# EAGLE design kicik (EAGLE 7.2.0)
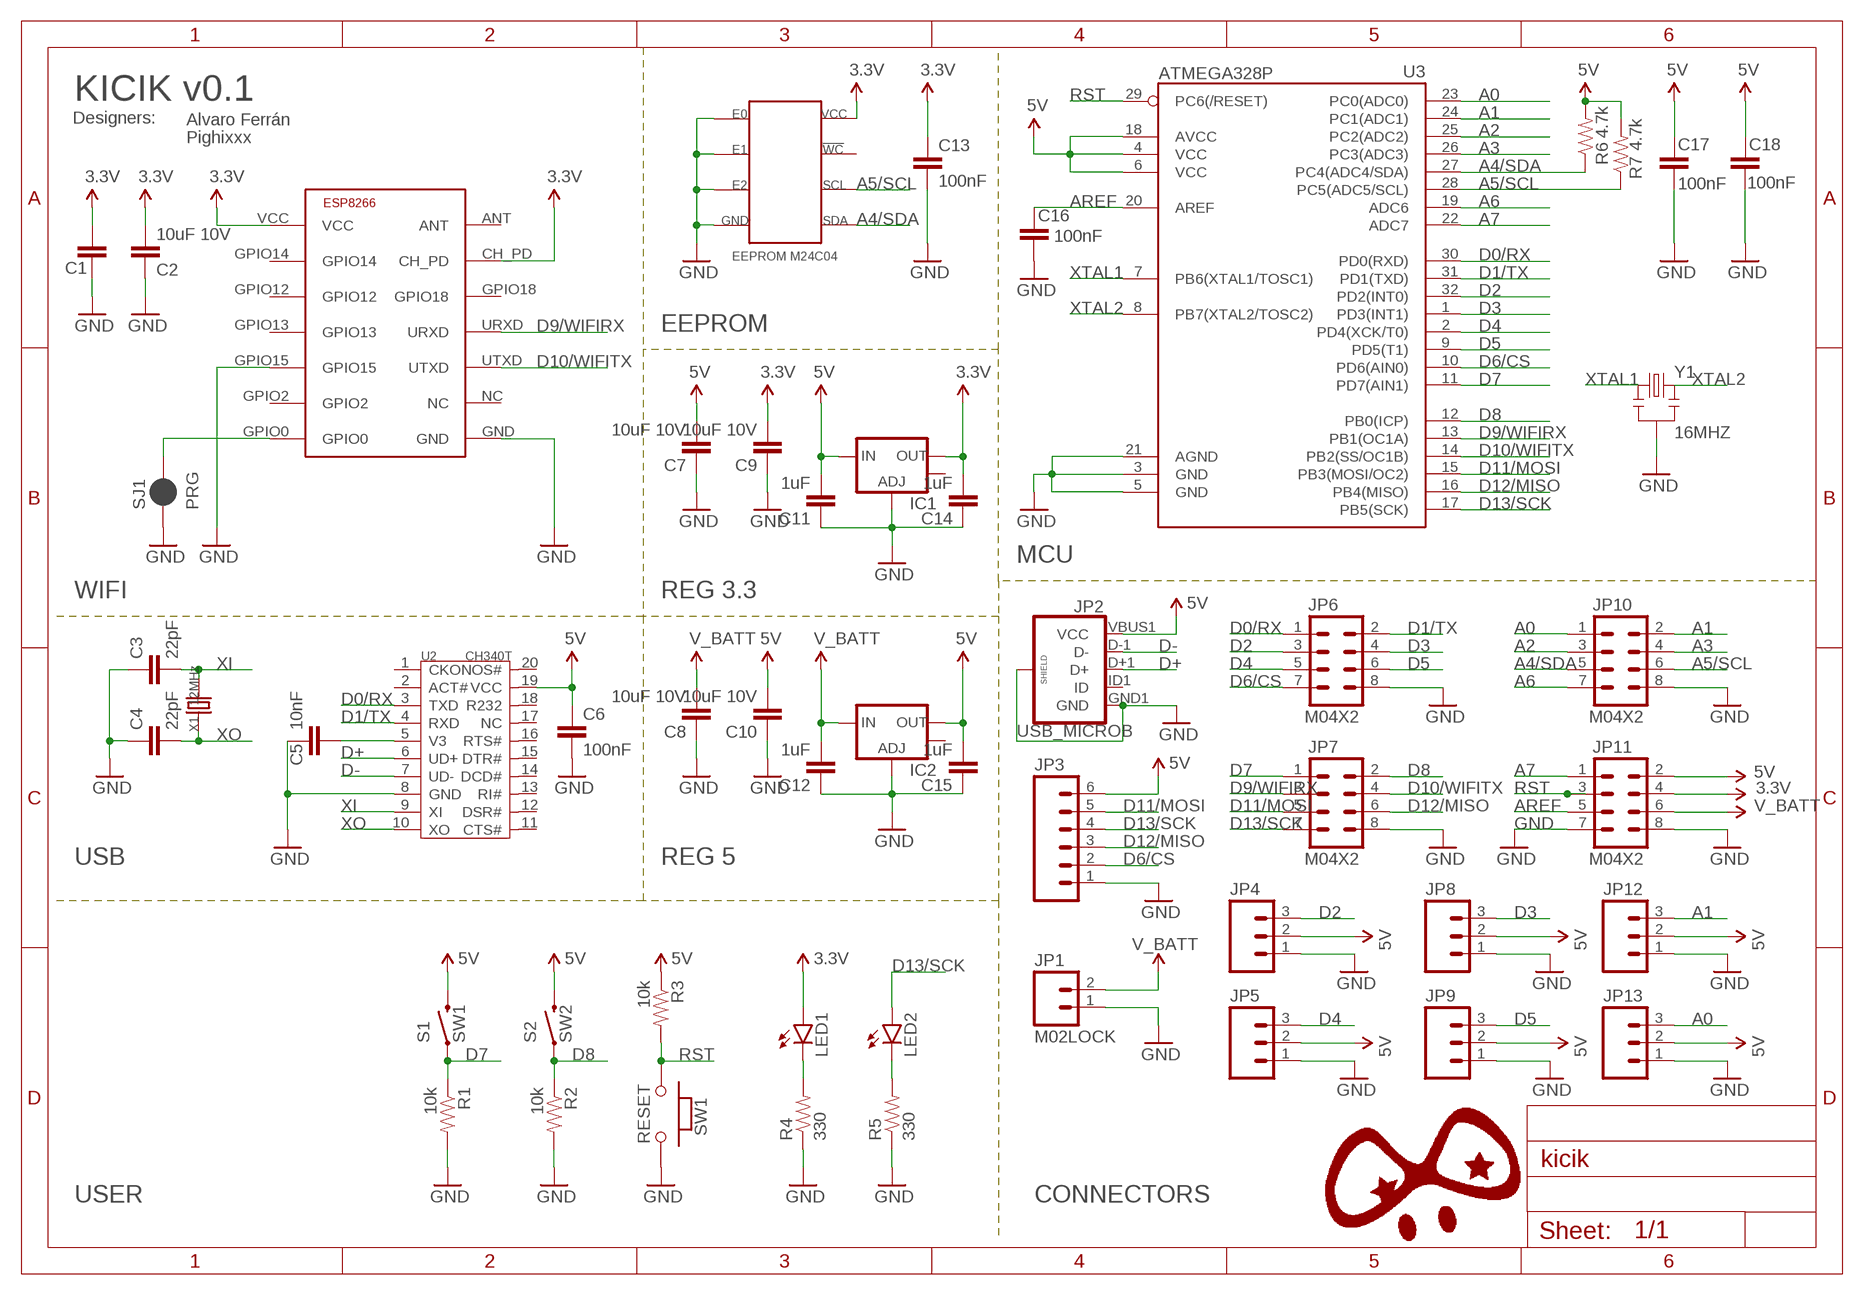
[diagram p0: schematic, sheet 1]

## Parts
C1  0.1uF  CAP0402-CAP  [0402-CAP]
C2  10uF 10V  CAP0402-CAP  [0402-CAP]
C3  22pF  CAP0402-CAP  [0402-CAP]
C4  22pF  CAP0402-CAP  [0402-CAP]
C5  10nF  CAP0402-CAP  [0402-CAP]
C6  100nF  CAP0402-CAP  [0402-CAP]
C7  10uF 10V  CAP0402-CAP  [0402-CAP]
C8  10uF 10V  CAP0402-CAP  [0402-CAP]
C9  10uF 10V  CAP0402-CAP  [0402-CAP]
C10  10uF 10V  CAP0402-CAP  [0402-CAP]
C11  1uF  CAP0402-CAP  [0402-CAP]
C12  1uF  CAP0402-CAP  [0402-CAP]
C13  100nF  CAP0402-CAP  [0402-CAP]
C14  1uF  CAP0402-CAP  [0402-CAP]
C15  1uF  CAP0402-CAP  [0402-CAP]
C16  100nF  CAP0402-CAP  [0402-CAP]
C17  100nF  CAP0402-CAP  [0402-CAP]
C18  100nF  CAP0402-CAP  [0402-CAP]
IC1  V_REG_LM1117SOT223  [SOT223]
IC2  V_REG_LM1117SOT223  [SOT223]
JP1  M02LOCK  [1X02_LOCK]
JP2  USB_MICROB  USB_MICROB_PLUGCONN-11752  [USB-B-MICRO-SMD_V03]
JP3  M06LOCK  [1X06_LOCK]
JP4  M03LOCK  [1X03_LOCK]
JP5  M03LOCK  [1X03_LOCK]
JP6  M04X2  [2X4]
JP7  M04X2  [2X4]
JP8  M03LOCK  [1X03_LOCK]
JP9  M03LOCK  [1X03_LOCK]
JP10  M04X2  [2X4]
JP11  M04X2  [2X4]
JP12  M03LOCK  [1X03_LOCK]
JP13  M03LOCK  [1X03_LOCK]
LED1  LED0603  [LED-0603]
LED2  LED0603  [LED-0603]
M1  M24C04  [SO08]
R1  10k  RESISTOR0402-RES  [0402-RES]
R2  10k  RESISTOR0402-RES  [0402-RES]
R3  10k  RESISTOR0402-RES  [0402-RES]
R4  330  RESISTOR0402-RES  [0402-RES]
R5  330  RESISTOR0402-RES  [0402-RES]
R6  4.7k  RESISTOR0402-RES  [0402-RES]
R7  4.7k  RESISTOR0402-RES  [0402-RES]
S1  SW1  SWITCH-MOMENTARY-2SIDE_EZ  [TACTILE-PTH-SIDEEZ]
S2  SW2  SWITCH-MOMENTARY-2SIDE_EZ  [TACTILE-PTH-SIDEEZ]
SJ1  PRG  JUMPER-PAD-2-NC_BY_PASTE  [PAD-JUMPER-2-NC_BY_PASTE_YES_SILK]
SW1  RESET  PB157  [157SW]
U1  ESP8266  [ESP-03]
U2  CH340T  [SSOP20]
U3  ATMEGA328P  ATMEGA328_SMT  [TQFP32-08]
X1  12MHz  CRYSTAL'5032'  [2P-SMD-5X3.2]
Y1  16MHZ  RESONATOR16MHZ  [RESONATOR-SMD]

## Nets
3.3V: C1.2 C2.2 C9.2 C13.1 C14.2 IC1.2(OUT) JP11.4 LED1.A M1.8(VCC) U1.CH_PD U1.VCC
5V: C6.1 C7.2 C10.2 C11.2 C15.2 C17.1 C18.1 IC1.3(IN) IC2.2(OUT) JP2.VBUS1(VCC) JP3.6 JP4.2 JP5.2 JP8.2 JP9.2 JP11.2 JP12.2 JP13.2 R3.1 R6.2 R7.2 S1.2 S2.2 U2.19(VCC) U3.4(VCC) U3.6(VCC) U3.18(AVCC)
A0: JP10.1 JP13.3 U3.23(PC0(ADC0))
A1: JP10.2 JP12.3 U3.24(PC1(ADC1))
A2: JP10.3 U3.25(PC2(ADC2))
A3: JP10.4 U3.26(PC3(ADC3))
A4/SDA: JP10.5 M1.5(SDA) R6.1 U3.27(PC4(ADC4/SDA))
A5/SCL: JP10.6 M1.6(SCL) R7.1 U3.28(PC5(ADC5/SCL))
A6: JP10.7 U3.19(ADC6)
A7: JP11.1 U3.22(ADC7)
AREF: C16.1 JP11.5 U3.20(AREF)
D0/RX: JP6.1 U2.3(TXD) U3.30(PD0(RXD))
D1/TX: JP6.2 U2.4(RXD) U3.31(PD1(TXD))
D2: JP4.3 JP6.3 U3.32(PD2(INT0))
D3: JP6.4 JP8.3 U3.1(PD3(INT1))
D4: JP5.3 JP6.5 U3.2(PD4(XCK/T0))
D5: JP6.6 JP9.3 U3.9(PD5(T1))
D6/CS: JP3.2 JP6.7 U3.10(PD6(AIN0))
D7: JP7.1 R1.1 S1.1 U3.11(PD7(AIN1))
D8: JP7.2 R2.1 S2.1 U3.12(PB0(ICP))
D9/WIFIRX: JP7.3 U1.URXD U3.13(PB1(OC1A))
D10/WIFITX: JP7.4 U1.UTXD U3.14(PB2(SS/OC1B))
D11/MOSI: JP3.5 JP7.5 U3.15(PB3(MOSI/OC2))
D12/MISO: JP3.3 JP7.6 U3.16(PB4(MISO))
D13/SCK: JP3.4 JP7.7 LED2.A U3.17(PB5(SCK))
D+: JP2.D+1(D+) U2.6(UD+)
D-: JP2.D-1(D-) U2.7(UD-)
GND: C1.1 C2.1 C3.1 C4.1 C5.1 C6.2 C7.1 C8.1 C9.1 C10.1 C11.1 C12.1 C13.2 C14.1 C15.1 C16.2 C17.2 C18.2 IC1.1(ADJ) IC2.1(ADJ) JP1.1 JP2.GND1(GND) JP2.SHIELD1(SHIELD) JP2.SHIELD2(SHIELD) JP2.SHIELD3(SHIELD) JP3.1 JP4.1 JP5.1 JP6.8 JP7.8 JP8.1 JP9.1 JP10.8 JP11.7 JP11.8 JP12.1 JP13.1 M1.1(E0) M1.2(E1) M1.3(E2) M1.4(GND) R1.2 R2.2 R4.1 R5.1 SJ1.1 SW1.2 U1.GND U1.GPIO15 U2.8(GND) U3.3(GND) U3.5(GND) U3.21(AGND) Y1.2
N$2: LED1.C R4.2
N$6: SJ1.2 U1.GPIO0
N$22: LED2.C R5.2
RST: JP11.3 R3.2 SW1.1 U3.29(PC6(/RESET))
V3: C5.2 U2.5(V3)
V_BATT: C8.2 C12.2 IC2.3(IN) JP1.2 JP11.6
XI: C3.2 U2.9(XI) X1.2
XO: C4.2 U2.10(XO) X1.1
XTAL1: U3.7(PB6(XTAL1/TOSC1)) Y1.1
XTAL2: U3.8(PB7(XTAL2/TOSC2)) Y1.3
Unconnected: IC1.4(OUT) IC2.4(OUT) JP2.ID1(ID) M1.7(!WC) U1.ANT U1.GPIO2 U1.GPIO12 U1.GPIO13 U1.GPIO14 U1.GPIO18 U1.NC U2.1(CKO) U2.2(ACT#) U2.11(CTS#) U2.12(DSR#) U2.13(RI#) U2.14(DCD#) U2.15(DTR#) U2.16(RTS#) U2.17(NC) U2.18(R232) U2.20(NOS#)

## Notes on the sheet
- KICIK v0.1
- Designers: | Alvaro Ferrán
- Pighixxx
- EEPROM
- MCU
- WIFI | REG 3.3
- USB | REG 5
- USER | CONNECTORS

## Library data of the parts
C1-C18 = SparkFun-Passives:CAP: Capacitor Standard 0603 ceramic capacitor, and 0.1" leaded capacitor.
IC1 IC2 = SparkFun-PowerIC:V_REG_LM1117: Voltage Regulator LM1117 Standard adjustable voltage regulator but in SMD form. Spark Fun Electronics SKU : COM-00595; PROD_ID: VREG-08170
JP1 = SparkFun-Connectors:M02: Standard 2-pin 0.1" header. Use with - straight break away headers ( PRT-00116) - right angle break away headers (PRT-00553) - swiss pins (PRT-00743) - machine pins (PRT-00117) - female headers (PRT-00115) Molex polarized connector foot print use with: PRT-08233 with associated crimp pins and housings. 2.54_SCREWTERM for use with PRT-10571. 3.5mm Screw Terminal footprints for PRT-08084 5mm Screw Terminal footprints for use with PRT-08432
JP2 = SparkFun-Connectors:USB_MICROB_PLUG: USB Micro-B connectors Some male, some female. Watch your step!; PROD_ID: CONN-11752
JP3 = SparkFun-Connectors:M06: Header 6 Standard 6-pin 0.1" header. Use with straight break away headers (SKU : PRT-00116), right angle break away headers (PRT-00553), swiss pins (PRT-00743), machine pins (PRT-00117), and female headers (PRT-00115). Molex polarized connector foot print use with SKU : PRT-08094 with associated crimp pins and housings. NOTES ON THE VARIANTS LOCK and LOCK_LONGPADS... This footprint was designed to help hold the alignment of a through-hole component (i.e. 6-pin header) while soldering it into place. You may notice that each hole has been shifted either up or down by 0.005 of an inch from it's more standard position (which is a perfectly straight line). This slight alteration caused the pins (the squares in the middle) to touch the edges of the holes. Because they are alternating, it causes a "brace" to hold the component in place. 0.005 has proven to be the perfect amount of "off-center" position when using our standard breakaway headers. Although looks a little odd when you look at the bare footprint, once you have a header in there, the alteration is very hard to notice. Also,if you push a header all the way into place, it is covered up entirely on the bottom side. This idea of altering the position of holes to aid alignment will be further integrated into the Sparkfun Library for other footprints. It can help hold any component with 3 or more connection pins.
JP4 JP5 JP8 JP9 JP12 JP13 = SparkFun-Connectors:M03: Header 3 Standard 3-pin 0.1" header. Use with straight break away headers (SKU : PRT-00116), right angle break away headers (PRT-00553), swiss pins (PRT-00743), machine pins (PRT-00117), and female headers (PRT-00115). Molex polarized connector foot print use with SKU : PRT-08232 with associated crimp pins and housings.
JP6 JP7 JP10 JP11 = SparkFun-Connectors:M04X2: .1" header, two rows of four.
LED1 LED2 = SparkFun-LED:LED: LEDs Standard schematic elements and footprints for 5mm, 3mm, 1206, and 0603 sized LEDs. 5mm - Spark Fun Electronics SKU : COM-00529 (and others)
M1 = pighiXXX:M24C04: ST MICROELECTRONICS M24C04-WMN6P Memory; EEPROM; I2C; 512x8bit; 2.5÷5.5V; SO8
R1-R7 = SparkFun-Passives:RESISTOR: Resistor Basic schematic elements and footprints for 0603, 1206, and PTH resistors.
S1 S2 = SparkFun-Electromechanical:SWITCH-MOMENTARY-2: Various NO switches- pushbuttons, reed, etc
SJ1 = SparkFun-Passives:JUMPER-PAD-2-NC_BY_PASTE
SW1 = MySMD:PB157
U1 = ESP8266:ESP8266: low cost Wifi to Serial Module
U2 = template:CH340T
U3 = SparkFun-DigitalIC:ATMEGA328_SMT: 32-Pin Atmega328 part Commonly used on Arduino compatible boards Available in QFP and QFN packages TQFP is IC-09069 QFN is non-stock; PROD_ID: IC-09069
X1 = Discrete:CRYSTAL*: CRYSTAL
Y1 = SparkFun-FreqCtrl:RESONATOR: Resonator Small SMD resonator. Used, eg, on the Arduino Pro/ Pro Mini boards. 8MHz- XTAL-08895 16MHz- XTAL-08900; PROD_ID: XTAL-08900

## Board
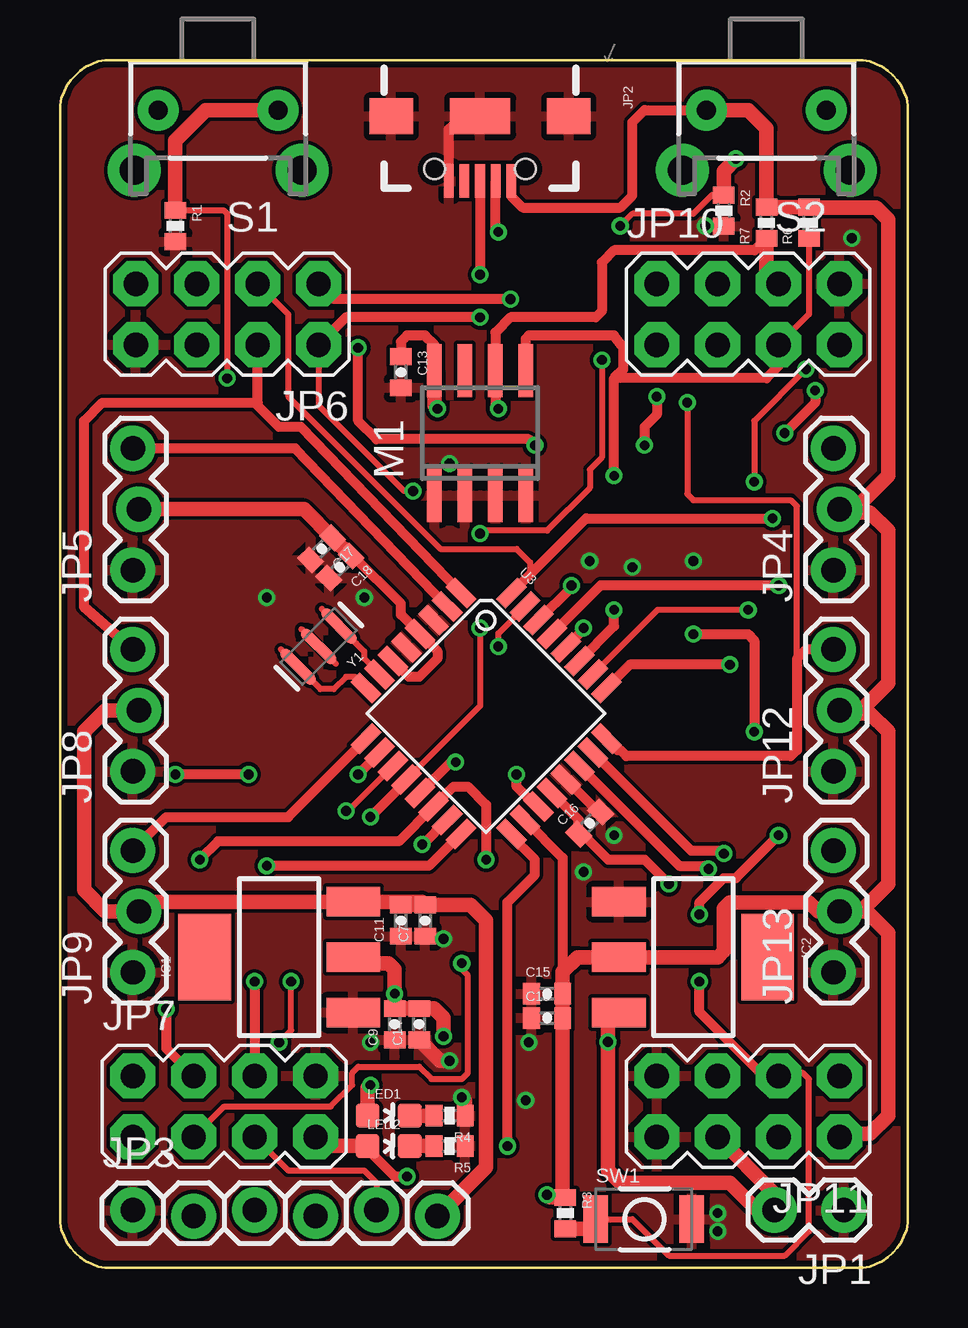
[diagram p1: board, top side]
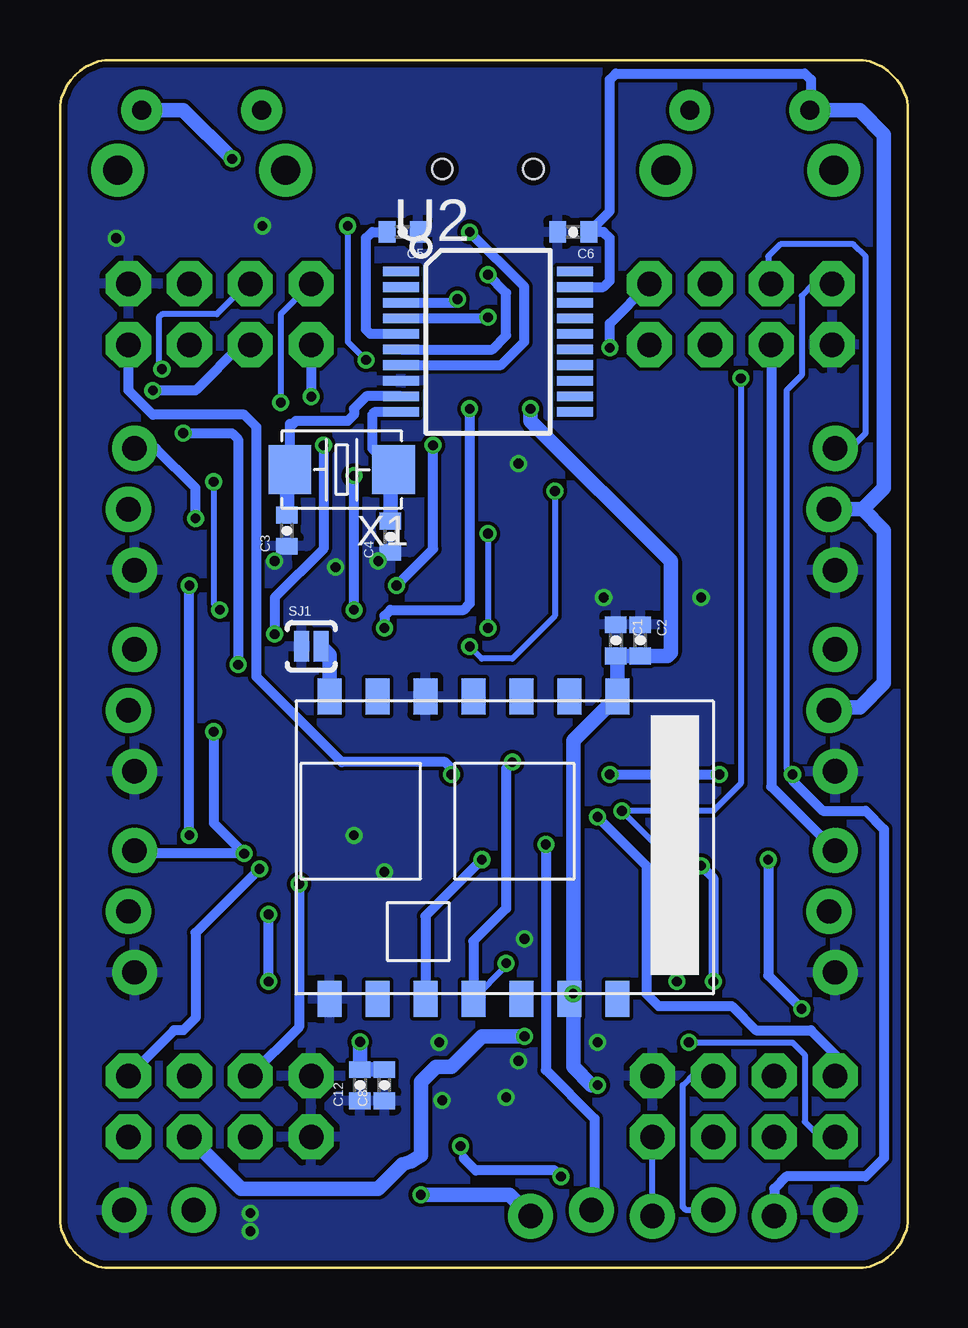
[diagram p2: board, bottom side, seen from below]

Size 35.35 x 50.35 mm. Coordinates in mm from the lower left corner, seen from the top.
Outline: 33.48,0 1.88,0 1.59,0.06 1.33,0.17 1.07,0.28 0.84,0.44 0.64,0.64 0.44,0.84 0.28,1.07 0.17,1.33 0.06,1.59 0,1.88 0,48.48 0.06,48.76 0.17,49.02 0.28,49.28 0.44,49.52 0.84,49.91 1.07,50.07 1.33,50.18 1.59,50.29 1.88,50.35 33.48,50.35 33.76,50.29 34.02,50.18 34.28,50.07 34.52,49.91 34.71,49.72 34.91,49.52 35.07,49.28 35.18,49.02 35.29,48.76 35.35,48.48 35.35,1.88 35.29,1.59 35.18,1.33 35.07,1.07 34.91,0.84 34.71,0.64 34.52,0.44 34.28,0.28 34.02,0.17 33.76,0.06 33.48,0
Copper layers (1*16): Top 0.035mm / dielectric 1.5mm / Bottom 0.035mm
Design rules "pighixxx_CAM_DRC_V1.0": minimum track width 6mil, minimum drill 12mil, track to track 6mil, track to pad 6mil, pad to pad 6mil, via to via 6mil, smd to smd 0mil, copper to edge 10mil, drill to drill 10mil, minimum pad ring 10mil, minimum via ring 6mil, stop-mask expansion 2mil, vias tented up to drill 100mil, thermal gap 10mil

### Footprints (pad centres in the part's own frame; a part is rotated, then mirrored left to right if it is on the bottom)
0402-CAP = smd 0.7 x 0.9: 1 -0.65,0; 2 0.65,0
SOT223 = smd 1.219 x 2.235: 1 -2.311,-3.099; 2 0,-3.099; 3 2.311,-3.099 | smd 3.6 x 2.2: 4 0,3.099
1X02_LOCK = drill 1.016 pad 1.88: 1 -0.178,0; 2 2.718,0
USB-B-MICRO-SMD_V03 = smd 1.4 x 0.4: D+1 2.7,0; D-1 2.7,0.65; GND1 2.7,-1.3; ID1 2.7,-0.65; VBUS1 2.7,1.3 | smd 1.5 x 1.8: SHIELD1 0,3.7; SHIELD2 0,-3.7 | smd 1.5 x 2.5: SHIELD3 0,0 | hole 0.85: 2.2,1.9; 2.2,-1.9
1X06_LOCK = drill 1.016 pad 1.88: 1 0,0; 2 2.54,-0.254; 3 5.08,0; 4 7.62,-0.254; 5 10.16,0; 6 12.7,-0.254
1X03_LOCK = drill 1.016 pad 1.88: 1 0,0.127; 2 2.54,-0.127; 3 5.08,0.127
2X4 = drill 1.016 pad 1.88 octagon: 1 -3.81,-1.27; 2 -3.81,1.27; 3 -1.27,-1.27; 4 -1.27,1.27; 5 1.27,-1.27; 6 1.27,1.27; 7 3.81,-1.27; 8 3.81,1.27
LED-0603 = smd 1 x 1: A 0,-0.877; C 0,0.877
SO08 = smd 0.6 x 2.2: 1 -1.905,-2.6; 2 -0.635,-2.6; 3 0.635,-2.6; 4 1.905,-2.6; 5 1.905,2.6; 6 0.635,2.6; 7 -0.635,2.6; 8 -1.905,2.6
0402-RES = smd 0.7 x 0.9: 1 -0.65,0; 2 0.65,0
TACTILE-PTH-SIDEEZ = drill 0.8 pad 1.7: 1 -2.5,0; 2 2.5,0 | drill 1.2 pad 2.2: ANCHOR1 -3.5,2.5; ANCHOR2 3.5,2.5
PAD-JUMPER-2-NC_BY_PASTE_YES_SILK = smd 0.635 x 1.27: 1 -0.401,0; 2 0.413,0
157SW = smd 1.016 x 1.981: 1 0,0; 2 4,0
ESP-03 = smd 1 x 1.5: ANT 4,12.4; CH_PD 6,12.4; GND 16,12.4; GPIO0 16,-0.2; GPIO2 14,-0.2; GPIO12 8,-0.2; GPIO13 10,-0.2; GPIO14 6,-0.2; GPIO15 12,-0.2; GPIO18 8,12.4; NC 14,12.4; URXD 10,12.4; UTXD 12,12.4; VCC 4,-0.2
SSOP20 = smd 0.4 x 1.5: 1 -2.925,-3.625; 2 -2.275,-3.625; 3 -1.625,-3.625; 4 -0.975,-3.625; 5 -0.325,-3.625; 6 0.325,-3.625; 7 0.975,-3.625; 8 1.625,-3.625; 9 2.275,-3.625; 10 2.925,-3.625; 11 2.925,3.625; 12 2.275,3.625; 13 1.625,3.625; 14 0.975,3.625; 15 0.325,3.625; 16 -0.325,3.625; 17 -0.975,3.625; 18 -1.625,3.625; 19 -2.275,3.625; 20 -2.925,3.625
TQFP32-08 = smd 1.27 x 0.559: 1 -4.293,2.8; 2 -4.293,2; 3 -4.293,1.2; 4 -4.293,0.4; 5 -4.293,-0.4; 6 -4.293,-1.2; 7 -4.293,-2; 8 -4.293,-2.8; 17 4.293,-2.8; 18 4.293,-2; 19 4.293,-1.2; 20 4.293,-0.4; 21 4.293,0.4; 22 4.293,1.2; 23 4.293,2; 24 4.293,2.8 | smd 0.559 x 1.27: 9 -2.8,-4.293; 10 -2,-4.293; 11 -1.2,-4.293; 12 -0.4,-4.293; 13 0.4,-4.293; 14 1.2,-4.293; 15 2,-4.293; 16 2.8,-4.293; 25 2.8,4.293; 26 2,4.293; 27 1.2,4.293; 28 0.4,4.293; 29 -0.4,4.293; 30 -1.2,4.293; 31 -2,4.293; 32 -2.8,4.293
2P-SMD-5X3.2 = smd 1.778 x 2.032: 1 -2.159,0; 2 2.159,0
RESONATOR-SMD = smd 0.45 x 1.905: 1 -1.2,0; 2 0,0; 3 1.2,0

### Placement (x,y rotation side)
C1  12.18,26.16 270 bottom
C2  11.16,26.16 270 bottom
C3  25.89,30.74 90 bottom
C4  21.58,30.48 90 bottom
C5  21.07,43.18 180 bottom
C6  13.96,43.18 180 bottom
C7  15.23,14.48 90 top
C8  21.83,7.62 90 bottom
C9  13.96,10.16 90 top
C10  20.31,10.42 0 top
C11  14.21,14.48 90 top
C12  22.85,7.62 90 bottom
C13  14.21,37.34 270 top
C14  14.97,10.16 90 top
C15  20.31,11.43 0 top
C16  22.08,18.54 45 top
C17  10.91,29.97 225 top
C18  11.67,29.21 225 top
IC1  9.13,12.96 90 top
IC2  26.4,12.96 270 top
JP1  32.5,2.42 180 top
JP2  17.51,48.01 270 top
JP3  3.03,2.42 0 top
JP4  32.37,29.09 90 top
JP5  3.16,29.09 90 top
JP6  6.97,39.75 180 top
JP7  6.84,6.73 0 top
JP8  3.16,20.7 90 top
JP9  3.16,12.32 90 top
JP10  28.69,39.75 0 top
JP11  28.69,6.73 180 top
JP12  32.37,20.7 90 top
JP13  32.37,12.32 90 top
LED1  13.7,6.35 270 top
LED2  13.7,5.08 270 top
M1  17.51,34.8 0 top
R1  4.81,43.44 270 top
R2  27.67,44.07 270 top
R3  21.07,2.29 270 top
R4  16.24,6.35 180 top
R5  16.24,5.08 180 top
R6  31.23,43.56 90 top
R7  29.45,43.56 90 top
S1  6.59,48.26 180 top
S2  29.45,48.26 180 top
SJ1  24.88,25.91 0 bottom
SW1  22.34,2.03 0 top
U1  8.11,23.62 180 bottom
U2  17.51,38.61 270 bottom
U3  17.77,23.12 315 top
X1  23.61,33.28 180 bottom
Y1  10.78,25.91 225 top

### Tracks (layer width: path | path; a pad name or v marks a point on that pad's centre or on a via)
3.3V  (via drill 0.41)
  Top 0.406: M1.8 15.61,38.48 15.23,38.86 14.46,38.86 14.21,38.61 C13.1
  Top 0.61: IC1.2 12.48,12.7 13.7,12.7 13.96,12.45 v13.96,11.43 C9.2 C14.2 15.59,10.81 15.99,10.42 v15.99,9.65 | LED1.A 12.83,7.51 v12.94,7.62 | M1.8 15.61,35.94 v15.73,35.82
  Bottom 0.61: U1.CH_PD 14.11,11.27 v13.96,11.43 | v12.94,7.62 13.19,7.62 13.96,8.38 v13.96,11.43 | JP11.4 27.8,3.3 22.08,3.3 21.07,4.32 20.69,4.45 20.31,4.7 20.31,7.75 19.67,8.38 19.04,8.38 17.77,9.65 v15.99,9.65 | v13.96,11.43 13.96,21.98 U1.VCC 12.11,25.45 C1.2 C2.2 10.03,25.51 9.89,25.66 9.89,29.47 15.73,35.31 v15.73,35.82
5V  (via drill 0.41)
  Top 0.406: C18.1 12.23,29.67 14.21,27.69 14.21,27.24 U3.4 15.73,25.71 15.73,25.4 14.97,24.64 14.55,24.64 U3.6 | U3.18 20.96,17.1 20.96,12.19 | JP2.VBUS1 18.81,44.68 19.29,44.2 23.35,44.2 23.86,44.71 23.86,47.75 24.37,48.26 S2.2
  Top 0.61: C7.2 C11.2 | v20.31,3.05 20.42,2.94 R3.1 20.96,3.05 C10.2 C15.2 20.96,12.19 20.96,12.34 21.58,12.96 IC2.2 27.42,12.96 27.67,13.21 27.67,14.99 27.93,15.24 31.23,15.24 31.61,14.86 JP13.2 | C7.2 15.09,15.27 IC1.3 3.69,15.27 JP9.2 1.89,14.86 1,15.75 1,22.35 1.89,23.24 JP8.2 | JP13.2 33.64,14.86 34.53,13.97 34.53,6.35 33.77,5.59 32.63,5.59 JP11.2 | JP13.2 33.39,14.86 34.53,16 34.53,22.35 33.77,23.12 32.63,23.12 JP12.2 33.39,23.24 34.53,24.39 34.53,30.74 33.77,31.5 32.63,31.5 JP4.2 33.13,31.63 34.53,33.02 34.53,43.69 34.02,44.2 31.24,44.2 R6.2 R7.2 29.45,47.5 28.69,48.26 S2.2 | C7.2 17.12,15.13 17.77,14.48 17.77,4.19 JP3.6 | JP5.2 10.18,31.63 C17.1 C18.1
  Bottom 0.406: U2.19 12.7,40.89 12.43,41.15 12.43,42.93 12.69,43.18 C6.1 12.43,44.06 12.43,49.53 12.18,49.79 4.3,49.79 4.05,49.53 4.05,48.3 S1.2
  Bottom 0.61: v20.31,3.05 16.62,3.05 JP3.6 | JP8.2 3.16,23.37 2.02,23.37 1,24.39 1,30.74 1.89,31.63 | 1.89,31.63 JP5.2 | S1.2 2.02,48.26 1,47.25 1,32.51 1.89,31.63
A0  (via drill 0.41)
  Top 0.406: U3.23 26.31,17.4 27.55,17.4 arc-90 v27.67,17.27 | v24.88,36.32 24.88,35.56 24.37,35.05 v24.37,34.29 | v26.4,26.42 28.69,26.42 28.94,26.16 v28.94,22.35
  Bottom 0.406: JP13.3 arc-90 32.12,17.27 v27.67,17.27 28.94,18.54 v28.94,22.35 | JP10.1 v24.88,36.32 | v24.37,34.29 24.37,29.97 26.4,27.94 v26.4,26.42
A1  (via drill 0.41)
  Top 0.254: 30.72,25.4 30.72,31.75 30.47,32.01 26.4,32.01 26.15,32.26 v26.15,36.07
  Top 0.406: JP12.3 31.1,25.78 30.72,25.4 30.72,21.59 30.47,21.34 23.61,21.34 23.35,21.59 23.25,21.59 U3.24
  Bottom 0.254: JP10.2 26.15,39.75 v26.15,36.07
A2  (via drill 0.41)
  Top 0.406: v31.48,36.58 31.48,36.07 v30.21,34.8 | v27.93,25.15 23.76,25.15 U3.25
  Bottom 0.406: JP10.3 27.8,38.48 29.7,36.58 v31.48,36.58 | v27.93,25.15 27.93,34.55 28.18,34.8 v30.21,34.8
A3  (via drill 0.41)
  Top 0.254: v28.69,27.43 24.91,27.43 U3.26 | v31.1,37.47 28.94,35.31 v28.94,32.77
  Bottom 0.254: JP10.4 27.55,41.02 28.82,39.75 31.1,39.75 31.23,39.63 31.23,37.59 v31.1,37.47 | v28.94,32.77 28.94,27.69 v28.69,27.43
A4/SDA  (via drill 0.41)
  Top 0.254: R6.1 31.23,39.75 JP10.5
  Top 0.406: M1.5 19.42,38.74 19.54,38.86 23.1,38.86 23.48,38.36 23.48,37.47 23.1,37.09 | JP10.5 29.96,37.59 29.45,37.09 23.1,37.09 | U3.27 23.1,26.75 v23.1,27.43 | v23.1,33.02 23.1,37.09
  Bottom 0.406: v23.1,27.43 v23.1,33.02
A5/SCL  (via drill 0.41)
  Top 0.406: R7.1 28.96,42.42 23.1,42.42 22.59,41.91 22.59,39.88 22.34,39.63 18.78,39.63 18.15,38.99 M1.6 18.15,35.94 v18.27,35.82 | v21.83,26.67 21.83,26.61 U3.28
  Top 0.61: JP10.6 29.45,41.53 R7.1
  Bottom 0.406: v18.27,35.82 18.27,27.69 18.53,27.43 21.58,27.43 21.83,27.18 v21.83,26.67
A6  (via drill 0.41)
  Top 0.406: U3.19 19.87,19.23 19.04,20.07 v19.04,20.58
  Bottom 0.406: v19.04,20.58 19.04,20.83 19.29,21.08 23.61,21.08 27.16,24.64 27.16,35.05 27.67,35.56 31.48,35.56 32.5,36.58 JP10.7
A7  (via drill 0.41)
  Top 0.406: U3.22 25.81,16.77 26.91,16.77 v27.04,16.64
  Bottom 0.406: v27.04,16.64 29.7,13.97 29.7,10.42 30.21,9.91 30.59,9.91 JP11.1
AREF  (via drill 0.41)
  Top 0.406: U3.20 21.62,18.69 C16.1 21.78,18.08 22.85,17.02 24.37,17.02 v25.39,16
  Bottom 0.406: v25.39,16 25.39,10.04 JP11.5
D0/RX  (via drill 0.41)
  Top 0.406: v18.78,40.39 11.42,40.39 JP6.1 | U3.30 21.32,28.37 v21.32,28.45 | v19.8,34.29 19.54,34.55 13.19,34.55 12.43,35.31 v12.43,38.36
  Bottom 0.406: U2.3 18.94,40.24 v18.78,40.39 | v21.32,28.45 19.8,29.97 v19.8,34.29 | v12.43,38.36 12.43,39.37 JP6.1
D1/TX  (via drill 0.41)
  Top 0.254: JP6.2 10.78,35.94 14.34,32.39 v14.72,32.39 | v18.27,25.91 18.27,26.45 U3.31
  Top 0.406: v17.51,39.63 11.92,39.63 JP6.2
  Bottom 0.254: v14.72,32.39 14.72,27.18 16.5,25.4 17.77,25.4 v18.27,25.91
  Bottom 0.406: U2.4 17.55,39.59 v17.51,39.63
D2  (via drill 0.41)
  Top 0.254: JP6.3 9.51,39.75 9.51,36.32 15.86,29.97 19.04,29.97 19.6,29.41 19.6,28.91
  Top 0.406: U3.32 19.6,28.91 21.93,31.24 v29.7,31.24
  Bottom 0.406: JP4.3 31.36,34.17 29.7,32.51 v29.7,31.24
D3
  Top 0.406: U3.1 10.05,35.05 9.13,35.05 8.24,35.94 8.24,36.07 | 8.24,36.07 JP6.4 | JP8.3 1,27.56 1,35.31 1.76,36.07 8.24,36.07
D4
  Top 0.406: U3.2 9.81,34.17 JP5.3
  Bottom 0.254: JP5.3 2.4,34.17 1.76,34.8 1.76,42.17 2.27,42.67 5.32,42.67 5.83,42.17 5.83,41.15 JP6.5
D5
  Top 0.406: JP9.3 4.43,18.8 9.51,18.8 U3.9
  Bottom 0.406: JP6.6 5.7,20.07 JP9.3
D6/CS  (via drill 0.41)
  Top 0.254: U3.10 13.32,21.46
  Top 0.406: 13.32,21.46 v12.43,20.58 | v7.86,20.58 v4.81,20.58
  Bottom 0.254: JP6.7 3.92,41.02 4.43,40.52 4.43,37.21 5.07,36.58 5.07,20.83 v4.81,20.58 4.81,20.32
  Bottom 0.406: v12.43,20.58 v7.86,20.58 | 4.81,20.32 3.54,19.05 1.76,19.05 1,18.29 1,4.57 1.76,3.81 5.07,3.81 5.57,3.3 JP3.2
D7  (via drill 0.41)
  Top 0.254: R1.1 6.83,44.09 6.97,43.94 v6.97,37.09 | v11.92,19.05 12.01,19.05 U3.11 | v9.64,11.94 9.64,9.91 v9.13,9.4
  Top 0.61: S1.1 6.08,48.26 4.81,46.99 R1.1
  Bottom 0.254: v6.97,37.09 6.97,20.2 8.11,19.05 v11.92,19.05 9.64,16.77 v9.64,11.94 | v9.13,9.4 4.81,9.4 4.3,8.89 4.3,6.1 3.8,5.59 3.16,5.59 JP7.1
D8  (via drill 0.41)
  Top 0.254: R2.1 27.18,44.72 26.4,43.94 23.86,43.94 v23.35,43.44 | v22.59,37.85 22.59,33.78 22.08,33.28 22.08,32.51 20.31,30.74 17.77,30.74 v17.51,30.61 | v17.51,26.67 17.51,23.43 U3.12
  Top 0.406: U3.12 14.45,20.31 v12.94,18.8
  Top 0.61: R2.1 27.67,45.72 v28.18,46.23
  Bottom 0.254: v23.35,43.44 23.35,38.61 v22.59,37.85 | v17.51,30.61 v17.51,26.67
  Bottom 0.406: v12.94,18.8 10.91,16.77 10.91,11.43 10.4,10.92 7.35,10.92 6.34,9.91 4.05,9.91 3.03,8.89 JP7.2
  Bottom 0.61: v28.18,46.23 30.21,48.26 S2.1
D9/WIFIRX  (via drill 0.41)
  Top 0.254: JP7.3 6.84,6.73 11.29,6.73 12.18,7.62 12.18,8.13 12.43,8.38 14.97,8.38 15.48,7.88 16.75,7.88 17,8.13 17,12.19 16.75,12.45 v16.75,12.7
  Top 0.406: U3.13 16.3,21.08 v16.5,21.08
  Bottom 0.254: v16.75,12.7 16.75,12.59 U1.URXD
  Bottom 0.406: v16.5,21.08 16.75,20.83 16.75,14.99 18.11,13.62 U1.URXD
D10/WIFITX  (via drill 0.41)
  Top 0.406: v17.77,17.02 17.77,19.31 17,20.07 16.42,20.07 U3.14 14.13,17.78 6.59,17.78 v5.83,17.02 | v4.43,10.8 4.43,9.15 JP7.4
  Bottom 0.406: v17.77,17.02 20.11,14.67 U1.UTXD | v5.83,17.02 5.83,12.19 v4.43,10.8
D11/MOSI  (via drill 0.41)
  Top 0.254: JP7.5 9.51,4.07 12.69,4.07 13.19,3.56 JP3.5
  Top 0.406: U3.15 15.1,17.62 v15.1,17.66
  Bottom 0.406: JP3.5 13.07,2.54 13.07,3.56 13.07,3.69 13.07,6.23 15.1,8.26 v15.1,17.66
D12/MISO  (via drill 0.41)
  Top 0.406: v8.11,11.94 JP7.6 | U3.16 15.38,16.77 v8.62,16.77
  Bottom 0.254: JP3.3 9.26,2.42 9.38,2.54 9.38,7.62 8.88,8.13 8.24,8.13 JP7.6
  Bottom 0.406: v8.62,16.77 8.11,16.26 v8.11,11.94
D13/SCK  (via drill 0.41)
  Top 0.254: LED2.A 12.83,4.94 | 18.82,18 U3.17
  Top 0.406: 12.83,4.94 13.96,3.81 v14.46,3.81 | v18.66,5.08 18.66,15.24 19.8,16.39 19.8,17.02 18.82,18
  Top 0.61: LED2.A 11.04,5.08 JP7.7
  Bottom 0.254: JP3.4 JP7.7 | v14.46,3.81 14.72,4.07 | 18.53,4.57 v18.66,5.08
  Bottom 0.406: 14.72,4.07 18.02,4.07 18.53,4.57
D+  (via drill 0.41)
  Top 0.406: JP2.D+1 v17.51,41.4
  Bottom 0.406: U2.6 17.33,38.29 16.75,38.86 16.75,40.64 v17.51,41.4
D-  (via drill 0.41)
  Top 0.406: v18.27,43.18 18.16,43.29 JP2.D-1
  Bottom 0.406: U2.7 16.96,37.64 15.99,38.61 15.99,40.9 v18.27,43.18
GND  (via drill 0.41)
  Top 0.406: JP2.GND1 16.21,47.47 16.75,48.01 JP2.SHIELD3 | C16.2 22.44,19 U3.21
  Top 0.61: C14.1 15.85,8.64 v16.24,8.64 | v16.75,7.11 16.89,6.97 R4.1
  other vias: 27.42,2.29 27.42,1.53 23.1,18.04 21.83,16.51 26.4,29.47 33.01,42.93 26.91,43.44 23.86,29.21 22.08,29.47 16.24,33.53 12.94,9.4 19.54,9.4 15.99,13.72 19.42,6.99 8.62,27.94 12.69,27.94
  pour Top: 35.29,50.55 35.55,0 -0.01,0 -0.01,50.29
  pour Bottom: 35.29,51.06 35.8,-0.51 -0.27,-0.51 -0.52,50.8
N$2
  Top 0.61: LED1.C R4.2
N$6
  Bottom 0.61: SJ1.2 24.11,25.56 U1.GPIO0
N$22
  Top 0.61: LED2.C R5.2
RST  (via drill 0.41)
  Top 0.254: SW1.1 23.86,2.03 25.39,0.51 30.21,0.51 31.23,1.53 31.23,7.88 30.97,8.13 30.09,8.13 JP11.3
  Top 0.406: v26.66,11.94 26.66,10.67 29.2,8.13 30.09,8.13 | v26.66,14.73 26.66,15.24 27.67,16.26 28.18,16.26 v29.96,18.04 | v29.96,28.45 22.53,28.45 U3.29
  Top 0.61: R3.2 22.2,1.64 SW1.1
  Bottom 0.406: v26.66,11.94 v26.66,14.73 | v29.96,18.04 v29.96,28.45
V3
  Bottom 0.406: U2.5 22.41,38.94 22.59,39.12 22.59,42.93 22.34,43.18 C5.2
V_BATT  (via drill 0.41)
  Top 0.61: JP11.6 29.78,3.1 JP1.2 29.07,2.42 27.93,3.56 23.35,3.56 22.85,4.07 v22.85,9.43 22.85,10.19 IC2.3
  Bottom 0.61: C8.2 C12.2 v22.85,9.43
XI
  Bottom 0.406: X1.2 25.77,35.05 | 25.77,35.05 25.77,35.18 | U2.9 22.58,36.34 23.1,35.82 23.1,35.56 23.35,35.31 25.51,35.31 25.77,35.05
  Bottom 0.61: C3.2 25.89,33.15 X1.2
XO
  Bottom 0.406: U2.10 22.22,35.69 22.34,35.56 22.34,34.17 X1.1
  Bottom 0.61: C4.2 21.58,33.15 X1.1
XTAL1
  Top 0.254: 12.35,26.04 12.69,25.7 12.69,25.4 13.32,24.77 U3.7
XTAL2
  Top 0.254: U3.8 12.28,24.64 11.92,24.64 11.42,24.13 10.86,24.13 10.65,24.34